# EAGLE design board (EAGLE 6.4)
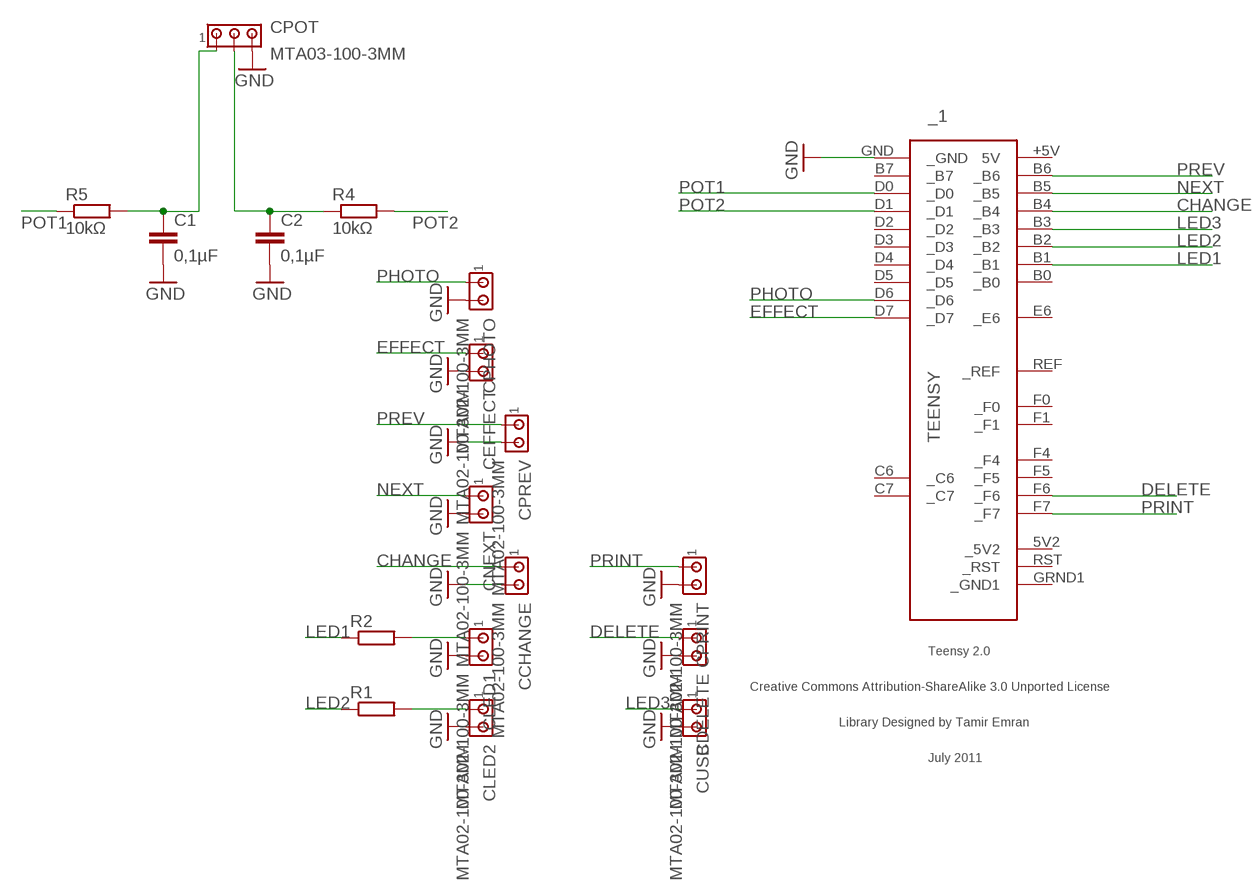
[diagram p0: schematic, sheet 1]

## Parts
_1  TEENSY  [TEENSY]
C1  0,1µF  C-EU050-025X075  [C050-025X075]
C2  0,1µF  C-EU050-025X075  [C050-025X075]
CCHANGE  MTA02-100-3MM  [10X02MTA3MM]
CDELETE  MTA02-100-3MM  [10X02MTA3MM]
CEFFECT  MTA02-100-3MM  [10X02MTA3MM]
CLED1  MTA02-100-3MM  [10X02MTA3MM]
CLED2  MTA02-100-3MM  [10X02MTA3MM]
CNEXT  MTA02-100-3MM  [10X02MTA3MM]
CPHOTO  MTA02-100-3MM  [10X02MTA3MM]
CPOT  MTA03-100-3MM  [10X03MTA3MM]
CPREV  MTA02-100-3MM  [10X02MTA3MM]
CPRINT  MTA02-100-3MM  [10X02MTA3MM]
CUSB  MTA02-100-3MM  [10X02MTA3MM]
R1  R-EU_0204/5  [0204/5]
R2  R-EU_0204/5  [0204/5]
R4  10kΩ  R-EU_0207/7  [0207/7]
R5  10kΩ  R-EU_0207/7  [0207/7]

## Nets
CHANGE: _1.B4(_B4) CCHANGE.1
DELETE: _1.F6(_F6) CDELETE.1
EFFECT: _1.D7(_D7) CEFFECT.1
GND: _1.GND(_GND) C1.2 C2.2 CCHANGE.2 CDELETE.2 CEFFECT.2 CLED1.2 CLED2.2 CNEXT.2 CPHOTO.2 CPOT.3 CPREV.2 CPRINT.2 CUSB.2
LED1: _1.B1(_B1) R2.1
LED2: _1.B2(_B2) R1.1
LED3: _1.B3(_B3) CUSB.1
N$1: CLED1.1 R2.2
N$2: CLED2.1 R1.2
N$4: C1.1 CPOT.1 R5.2
N$5: C2.1 CPOT.2 R4.1
NEXT: _1.B5(_B5) CNEXT.1
PHOTO: _1.D6(_D6) CPHOTO.1
POT1: _1.D0(_D0) R5.1
POT2: _1.D1(_D1) R4.2
PREV: _1.B6(_B6) CPREV.1
PRINT: _1.F7(_F7) CPRINT.1
Unconnected: _1.5V2(_5V2) _1.+5V(5V) _1.B0(_B0) _1.B7(_B7) _1.C6(_C6) _1.C7(_C7) _1.D2(_D2) _1.D3(_D3) _1.D4(_D4) _1.D5(_D5) _1.E6(_E6) _1.F0(_F0) _1.F1(_F1) _1.F4(_F4) _1.F5(_F5) _1.GRND1(_GND1) _1.REF(_REF) _1.RST(_RST)

## Library data of the parts
_1 = teensy:TEENSY: Teensy 2.0 Original Design by Clint Fisher Modified Design by Tamir Emran Licensed Under Creative Commons Attribution-ShareAlike 3.0 Unported (CC BY-SA 3.0)
C1 C2 = rcl:C-EU: CAPACITOR, European symbol
CCHANGE CDELETE CEFFECT CLED1 CLED2 CNEXT CPHOTO CPREV CPRINT CUSB = con-amp:MTA02-100-3MM
CPOT = con-amp:MTA03-100-3MM
R1 R2 R4 R5 = resistor:R-EU_: RESISTOR, European symbol

## Board
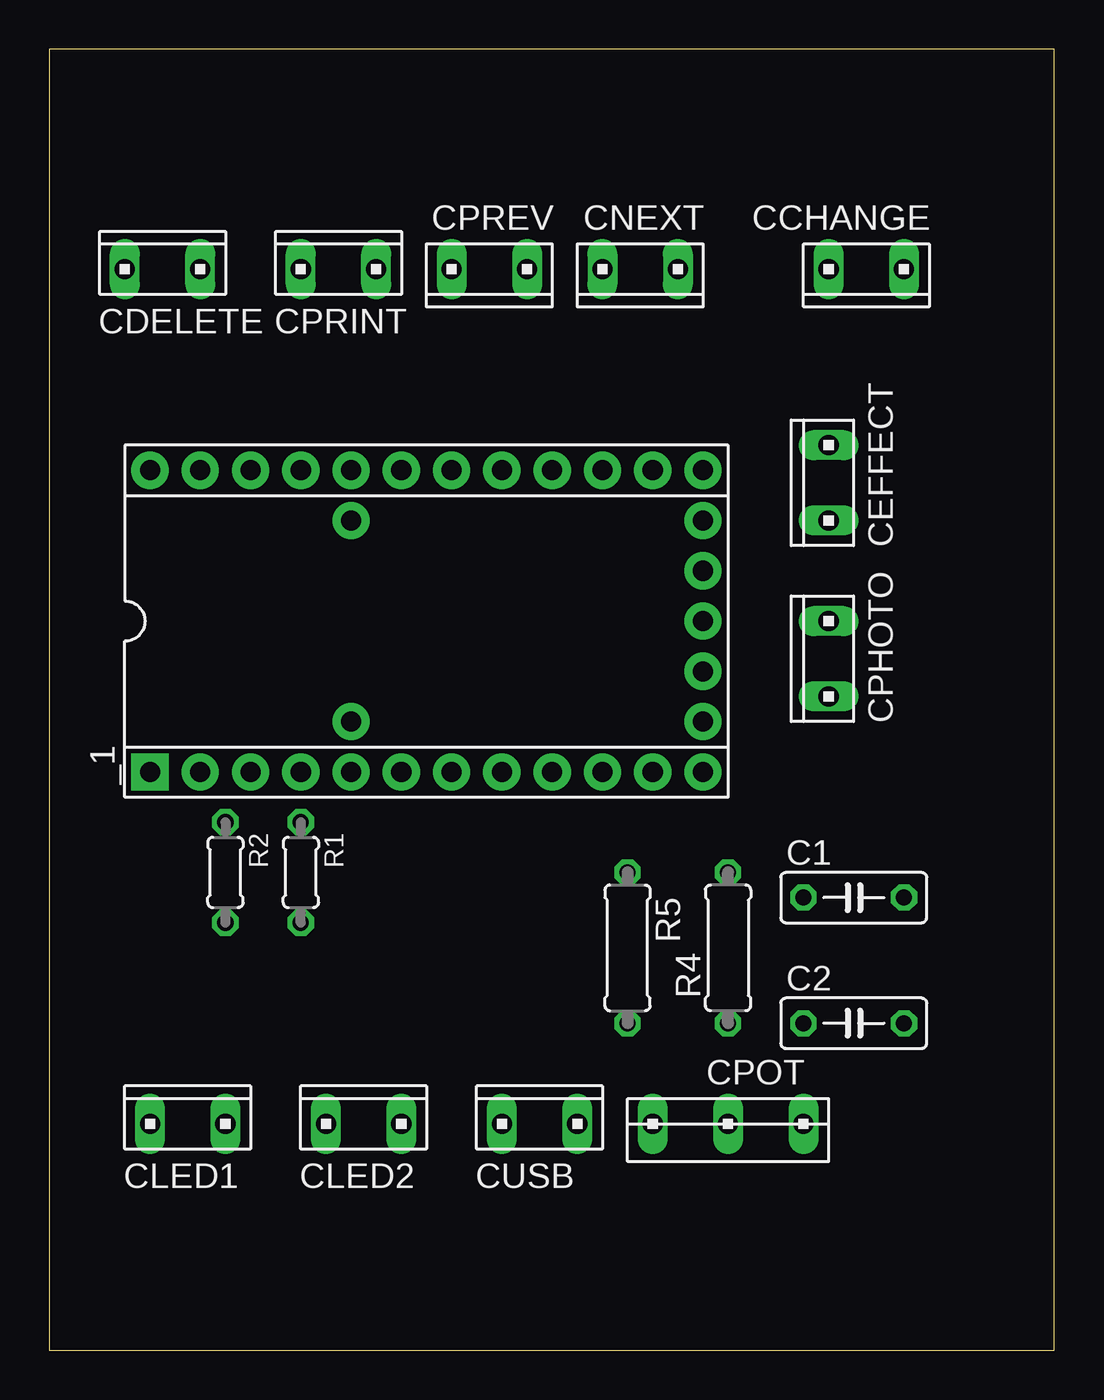
[diagram p1: board, top side]
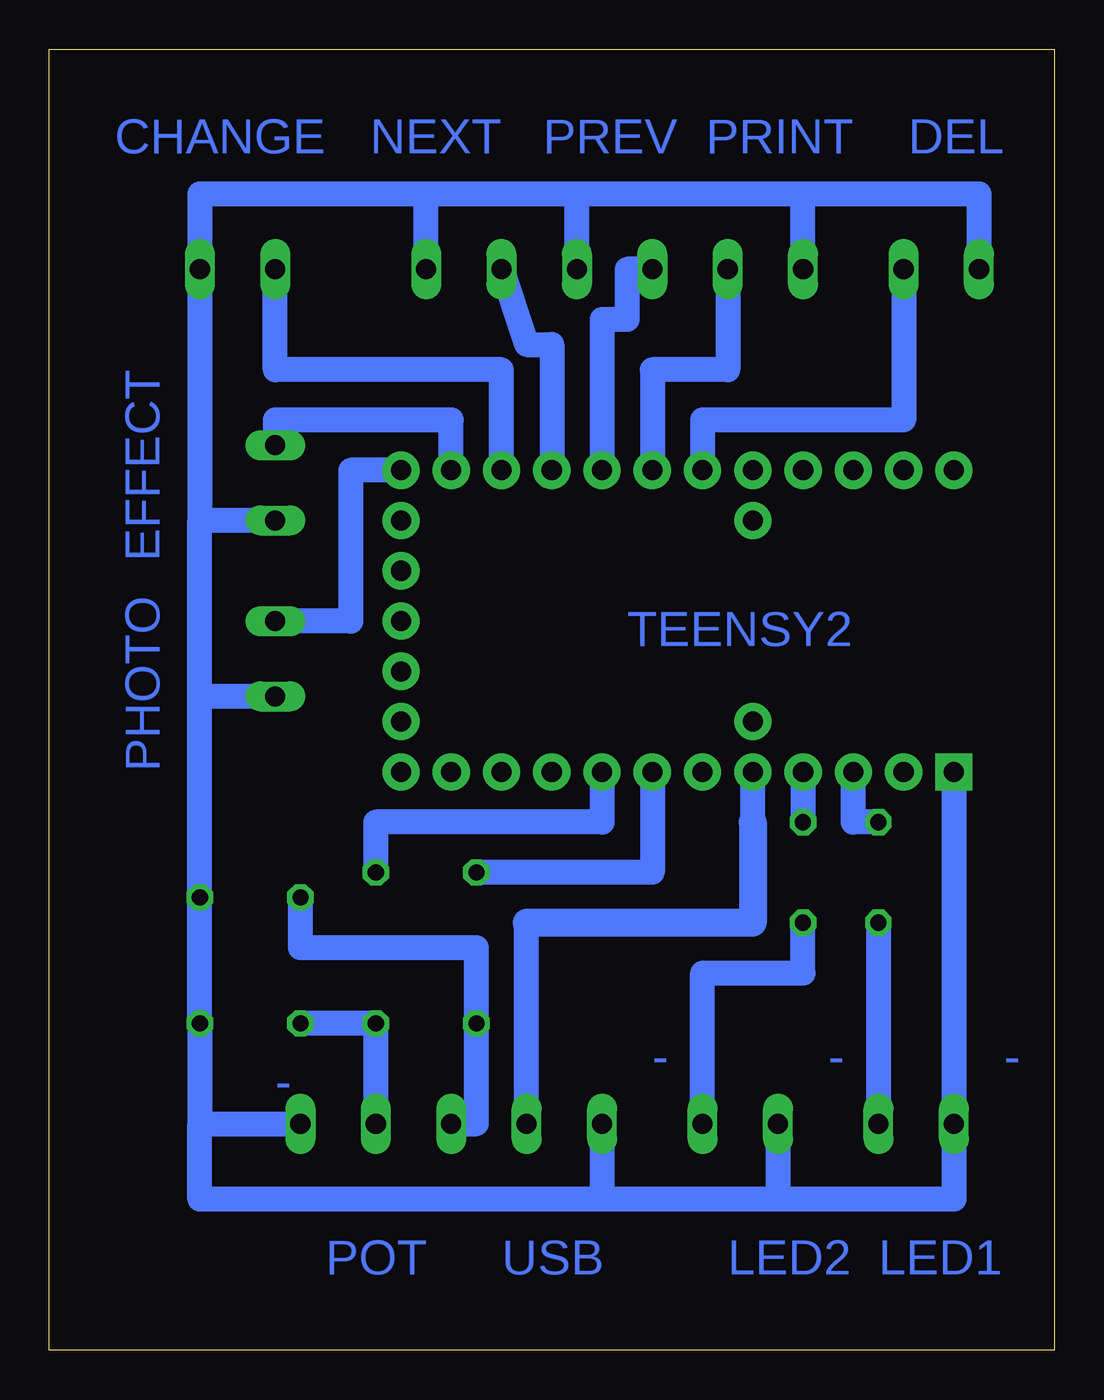
[diagram p2: board, bottom side, seen from below]

Size 50.78 x 65.71 mm. Coordinates in mm from the lower left corner, seen from the top.
Outline: 0,0 50.78,0 50.78,65.71 0,65.71 0,0
Copper layers (1*16): Top 0.035mm / dielectric 1.5mm / Bottom 0.035mm
Design rules "default": minimum track width 10mil, minimum drill 24mil, track to track 8mil, track to pad 8mil, pad to pad 8mil, via to via 8mil, smd to smd 8mil, copper to edge 40mil, drill to drill 8mil, minimum pad ring 10mil, minimum via ring 8mil, stop-mask expansion 4mil, vias tented up to drill 0mil, thermal gap 10mil

### Footprints (pad centres in the part's own frame; a part is rotated, then mirrored left to right if it is on the bottom)
TEENSY = drill 1.016 pad 1.88: 5V2 13.97,-2.54; +5V -13.97,7.62; B0 -11.43,-7.62; B1 -8.89,-7.62; B2 -6.35,-7.62; B3 -3.81,-7.62; B4 8.89,7.62; B5 6.35,7.62; B6 3.81,7.62; B7 -1.27,-7.62; C6 11.43,-7.62; C7 13.97,-7.62; D0 1.27,-7.62; D1 3.81,-7.62; D2 6.35,-7.62; D3 8.89,-7.62; D4 13.97,5.08; D5 13.97,-5.08; D6 13.97,7.62; D7 11.43,7.62; E6 -3.81,-5.08; F0 -11.43,7.62; F1 -8.89,7.62; F4 -6.35,7.62; F5 -3.81,7.62; F6 -1.27,7.62; F7 1.27,7.62; GRND1 13.97,0; REF -3.81,5.08; RST 13.97,2.54 | drill 1.016 pad 1.88 square: GND -13.97,-7.62
C050-025X075 = drill 0.813 octagon: 1 -2.54,0; 2 2.54,0
10X02MTA3MM = drill 1.016 long: 1 3.81,0; 2 0,0
10X03MTA3MM = drill 1.016 long: 1 8.89,1.27; 2 5.08,1.27; 3 1.27,1.27
0204/5 = drill 0.813 octagon: 1 -2.54,0; 2 2.54,0
0207/7 = drill 0.813 octagon: 1 -3.81,0; 2 3.81,0

### Placement (x,y rotation side)
_1  19.05,36.83 0 top
C1  40.64,22.86 0 top
C2  40.64,16.51 0 top
CCHANGE  43.18,54.61 180 top
CDELETE  3.81,54.61 0 top
CEFFECT  39.37,41.91 90 top
CLED1  5.08,11.43 0 top
CLED2  13.97,11.43 0 top
CNEXT  31.75,54.61 180 top
CPHOTO  39.37,33.02 90 top
CPOT  39.37,12.7 180 top
CPREV  24.13,54.61 180 top
CPRINT  12.7,54.61 0 top
CUSB  22.86,11.43 0 top
R1  12.7,24.13 270 top
R2  8.89,24.13 270 top
R4  34.29,20.32 90 top
R5  29.21,20.32 270 top

### Tracks (layer width: path | path; a pad name or v marks a point on that pad's centre or on a via)
CHANGE
  Bottom 1.27: _1.B4 27.94,49.53 39.37,49.53 CCHANGE.1
DELETE
  Bottom 1.27: CDELETE.1 7.62,46.99 17.78,46.99 _1.F6
EFFECT
  Bottom 1.27: _1.D7 30.48,46.99 39.37,46.99 CEFFECT.1
GND
  Bottom 1.27: _1.GND CLED1.2 5.08,7.62 13.97,7.62 | CLED2.2 13.97,7.62 | 13.97,7.62 22.86,7.62 | CUSB.2 22.86,7.62 | 22.86,7.62 43.18,7.62 43.18,11.43 | CPHOTO.2 43.18,33.02 | 43.18,33.02 43.18,41.91 | 31.75,58.42 43.18,58.42 CCHANGE.2 43.18,41.91 | CNEXT.2 31.75,58.42 | 31.75,58.42 24.13,58.42 | CPREV.2 24.13,58.42 | 24.13,58.42 12.7,58.42 | CPRINT.2 12.7,58.42 | 12.7,58.42 3.81,58.42 CDELETE.2 | CEFFECT.2 43.18,41.91 | 43.18,11.43 C2.2 C1.2 43.18,33.02 | 43.18,11.43 CPOT.3
LED1
  Bottom 1.27: R2.1 10.16,26.67 _1.B1
LED2
  Bottom 1.27: _1.B2 R1.1
LED3
  Bottom 1.27: 15.24,26.67 _1.B3 | CUSB.1 26.67,21.59
  Bottom 1.422: 15.24,26.67 15.24,21.59 26.67,21.59
N$1
  Bottom 1.27: R2.2 CLED1.1
N$2
  Bottom 1.27: CLED2.1 17.78,19.05 12.7,19.05 R1.2
N$4
  Bottom 1.27: CPOT.1 29.21,11.43 R5.2 29.21,20.32 38.1,20.32 C1.1
N$5
  Bottom 1.27: C2.1 R4.1 CPOT.2
NEXT
  Bottom 1.27: CNEXT.1 26.67,50.8 25.4,50.8 _1.B5
PHOTO
  Bottom 1.27: _1.D6 35.56,44.45 35.56,36.83 CPHOTO.1
POT1
  Bottom 1.27: _1.D0 20.32,24.13 R5.1
POT2
  Bottom 1.27: _1.D1 22.86,26.67 34.29,26.67 R4.2
PREV
  Bottom 1.27: CPREV.1 21.59,54.61 21.59,53.34 21.59,52.07 22.86,52.07 22.86,50.8 _1.B6
PRINT
  Bottom 1.27: CPRINT.1 16.51,49.53 20.32,49.53 _1.F7

### Text on the board
Bottom: DEL | PRINT | PREV | NEXT | CHANGE | EFFECT | PHOTO | TEENSY2 | - | - | - | - | LED1 | LED2 | USB | POT